# EAGLE design LONGAN_CORE (EAGLE 6.4)
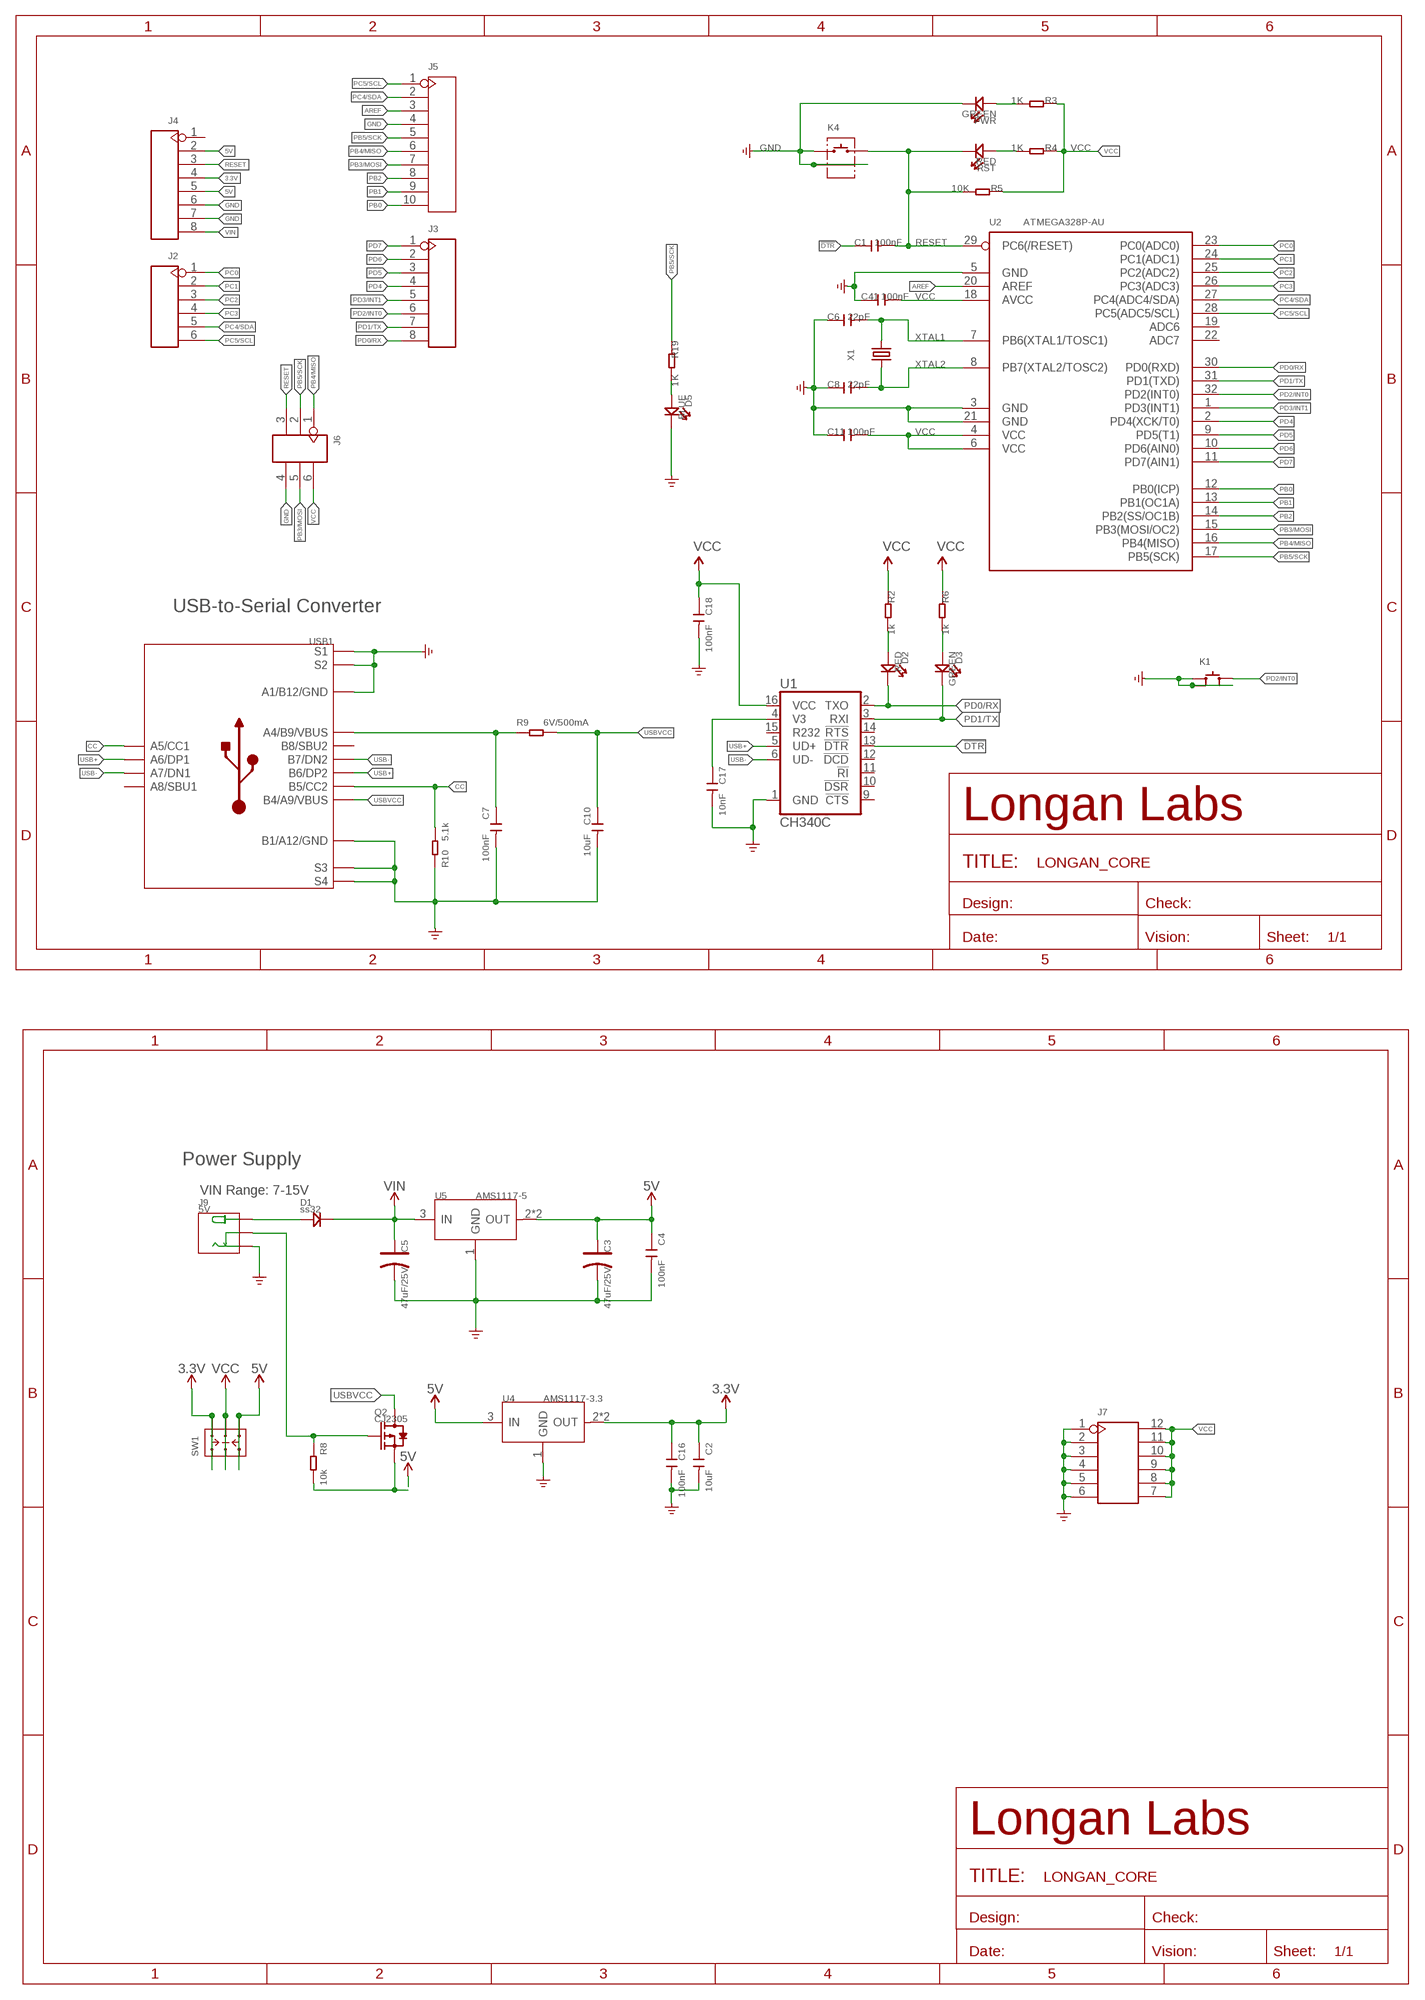
[diagram p0: schematic, sheet 1]

## Parts
C1  100nF  C-0603  [C0603]
C2  10uF  CAP-0603  [C0603]
C3  47uF/25V  CAP-POLAR-ELECTRO-C  [ELECTRO-SMD-C-6MM]
C4  100nF  CAP-0603  [C0603]
C5  47uF/25V  CAP-POLAR-ELECTRO-C  [ELECTRO-SMD-C-6MM]
C6  22pF  C-0603  [C0603]
C7  100nF  CAP-0603  [C0603]
C8  22pF  C-0603  [C0603]
C10  10uF  CAP-0603  [C0603]
C11  100nF  C-0603  [C0603]
C16  100nF  CAP-0603  [C0603]
C17  10nF  CAP-0603  [C0603]
C18  100nF  CAP-0603  [C0603]
C41  100nF  C-0603  [C0603]
D1  ss32  DIODE'SMA'  [DO-214AC]
D2  RED  LED'0603'  [LED-0603]
D3  GREEN  LED'0603'  [LED-0603]
D5  BLUE  LED'0603'  [LED-0603]
J2  HEADER-6P-55/35MIL  [H6-2.54]
J3  HEADER-8P-65/35MIL  [H8-2.54-C65D35MIL]
J4  HEADER-8P-65/35MIL  [H8-2.54-C65D35MIL]
J5  HEADER-10P-2.54  [H10-2.54]
J6  HEADER-2X3P-2.54  [H2X3-2.54]
J7  HEADER-2X6P-2.54  [H2X6-2.54]
J9  5V  POWER-JACK-DC-320120003  [DCJ3P-14.2X11.0X9.0MM]
K1  BUTTON-4P-6.2X6.2  [SW4-SMD-6.2X6.2MM]
K4  BUTTON-2+2P  [SW2+2P-7.7X2.75X3.95MM]
PWR  GREEN  LED'0603'  [LED-0603]
Q2  CJ2305  MOSFET-P'SI2323CDS/SI2305DS<BR>'  [SOT-23]
R2  1k  R-0603  [R0603]
R3  1K  R-0603  [R0603]
R4  1K  R-0603  [R0603]
R5  10K  R-0603  [R0603]
R6  1k  R-0603  [R0603]
R8  10k  RES-0603  [R0603]
R9  6V/500mA  RES-0805  [R0805]
R10  5.1k  RES-0603  [R0603]
R19  1K  R-0603  [R0603]
RST  RED  LED'0603'  [LED-0603]
SW1  SWITCH-2CH-6P-311010004  [SW6-2.54-9.0X3.5X3.2+2.0MM]
U1  CH340C  [SO016]
U2  ATMEGA328P-AU  MCU-ATMEGA8/168/328'AU'  [TQFP32-0.8-7X7MM]
U4  AMS1117-3.3  PMIC-CJ1117S  [SOT-223]
U5  AMS1117-5  PMIC-CJ1117S  [SOT-223]
USB1  TYPE-C-31-M-12  USB2.0-TYPE-C  [USB2.0-TYPE-C]
X1  16MHz  CRYSTAL-2P'HC49US'  [HC49US]

## Nets
3.3V: C2.1 C16.1 J4.4 SW1.CH1A SW1.CH2A U4.2(OUT) U4.TER(OUT)
5V: C3.+ C4.1 J4.2 J4.5 Q2.2(S) R8.2 SW1.CH1B SW1.CH2B U4.3(IN) U5.2(OUT) U5.TER(OUT)
!DTR: C1.1 U1.13(!DTR)
AREF: J5.3 U2.20(AREF)
CC: R10.2 USB1.A5(A5/CC1) USB1.B5(B5/CC2)
GND: C2.2 C3.- C4.2 C5.- C6.1 C7.2 C8.1 C10.2 C11.1 C16.2 C17.2 C18.2 C41.1 D5.- J4.6 J4.7 J5.4 J6.4 J7.1 J7.2 J7.3 J7.4 J7.5 J7.6 J9.-1(-) K1.1(A0) K1.3(B1) K1.4(A1) K4.1 K4.S1 K4.S2 PWR.- R10.1 U1.1(GND) U2.3(GND) U2.5(GND) U2.21(GND) U4.1(GND) U5.1(GND) USB1.A1_B12(A1/B12/GND) USB1.B1_A12(B1/A12/GND) USB1.S1 USB1.S2 USB1.S3 USB1.S4 USB1.S5(S1) USB1.S6(S2) ; supply symbol labelled GND_POWER
INSERT: J9.-2(CDN) Q2.1(G) R8.1
N$3: D5.+ R19.2
N$4: C7.1 R9.1 USB1.A4_B9(A4/B9/VBUS)
N$5: D3.+ R6.2
N$6: C17.1 U1.4(V3)
N$7: PWR.+ R3.2
N$9: D2.+ R2.2
N$17: R4.2 RST.+
PB0: J5.10 U2.12(PB0(ICP))
PB1: J5.9 U2.13(PB1(OC1A))
PB2: J5.8 U2.14(PB2(SS/OC1B))
PB3/MOSI: J5.7 J6.5 U2.15(PB3(MOSI/OC2))
PB4/MISO: J5.6 J6.1 U2.16(PB4(MISO))
PB5/SCK: J5.5 J6.2 R19.1 U2.17(PB5(SCK))
PC0: J2.1 U2.23(PC0(ADC0))
PC1: J2.2 U2.24(PC1(ADC1))
PC2: J2.3 U2.25(PC2(ADC2))
PC3: J2.4 U2.26(PC3(ADC3))
PC4/SDA: J2.5 J5.2 U2.27(PC4(ADC4/SDA))
PC5/SCL: J2.6 J5.1 U2.28(PC5(ADC5/SCL))
PD0/RX: D2.- J3.8 U1.2(TXO) U2.30(PD0(RXD))
PD1/TX: D3.- J3.7 U1.3(RXI) U2.31(PD1(TXD))
PD2/INT0: J3.6 K1.2(B0) U2.32(PD2(INT0))
PD3/INT1: J3.5 U2.1(PD3(INT1))
PD4: J3.4 U2.2(PD4(XCK/T0))
PD5: J3.3 U2.9(PD5(T1))
PD6: J3.2 U2.10(PD6(AIN0))
PD7: J3.1 U2.11(PD7(AIN1))
PWRIN: D1.1(+) J9.+
RESET: C1.2 J4.3 J6.3 K4.2 R5.2 RST.- U2.29(PC6(/RESET))
USB+: U1.5(UD+) USB1.A6(A6/DP1) USB1.B6(B6/DP2)
USB-: U1.6(UD-) USB1.A7(A7/DN1) USB1.B7(B7/DN2)
USBVCC: C10.1 Q2.3(D) R9.2 USB1.B4_A9(B4/A9/VBUS)
VCC: C11.2 C18.1 C41.2 J6.6 J7.7 J7.8 J7.9 J7.10 J7.11 J7.12 R2.1 R3.1 R4.1 R5.1 R6.1 SW1.COM1 SW1.COM2 U1.16(VCC) U2.4(VCC) U2.6(VCC) U2.18(AVCC)
VIN: C5.+ D1.2(-) J4.8 U5.3(IN)
XTAL1: C6.2 U2.7(PB6(XTAL1/TOSC1)) X1.2
XTAL2: C8.2 U2.8(PB7(XTAL2/TOSC2)) X1.1
Unconnected: J4.1 U1.9(!CTS) U1.10(!DSR) U1.11(!RI) U1.12(!DCD) U1.14(!RTS) U1.15(R232) U2.19(ADC6) U2.22(ADC7) USB1.A8(A8/SBU1) USB1.B8(B8/SBU2)

## Notes on the sheet
- USB-to-Serial Converter
- Power Supply
- VIN Range: 7-15V

## Library data of the parts
C1 C6 C8 C11 C41 = Discrete:C*: Ceramic Capacitors
C2 C4 C7 C10 C16-C18 = Discrete-new:CAP: Ceramic Capacitors
C3 C5 = Discrete-new:CAP-POLAR: Electrolytic Capacitors,Tantalum Capacitors and Super Capacitors
D1 = Discrete-new:DIODE
D2 D3 D5 PWR RST = Discrete-new:LED
J2 = Connector-new:HEADER-6P
J3 J4 = Connector-new:HEADER-8P
J5 = Connector-new:HEADER-10P
J6 = Connector-new:HEADER-2X3P
J7 = Connector-new:HEADER-2X6P
J9 = Connector-new:POWER-JACK-DC
K1 = Switch:BUTTON-4P
K4 = Connector-new:BUTTON-2+2P
Q2 = Discrete-new:MOSFET-P
R2-R6 R19 = Discrete:R*
R8-R10 = Discrete-new:RES
SW1 = Switch:SWITCH-2CH-6P
U1 = SparkFun-IC-Comms:CH340C; PROD_ID: IC-14038
U2 = IC-new:MCU-ATMEGA8/168/328
U4 U5 = IC-new:PMIC-CJ*1117: Low Drop Fixed And Adjustable Positive Voltage Regulators http://www.datasheetcatalog.org/datasheet/SGSThomsonMicroelectronics/mXuqtqv.pdf
USB1 = Connector-new:USB2.0-TYPE-C
X1 = Discrete-new:CRYSTAL-2P

## Net classes
1 power: width 0.152 mm, drill 0.152 mm, clearance 0.152 mm
2 gnd: width 0.152 mm, drill 0.152 mm, clearance 0.152 mm
3 usbvcc: width 0.152 mm, drill 0.152 mm, clearance 0.152 mm

## Board
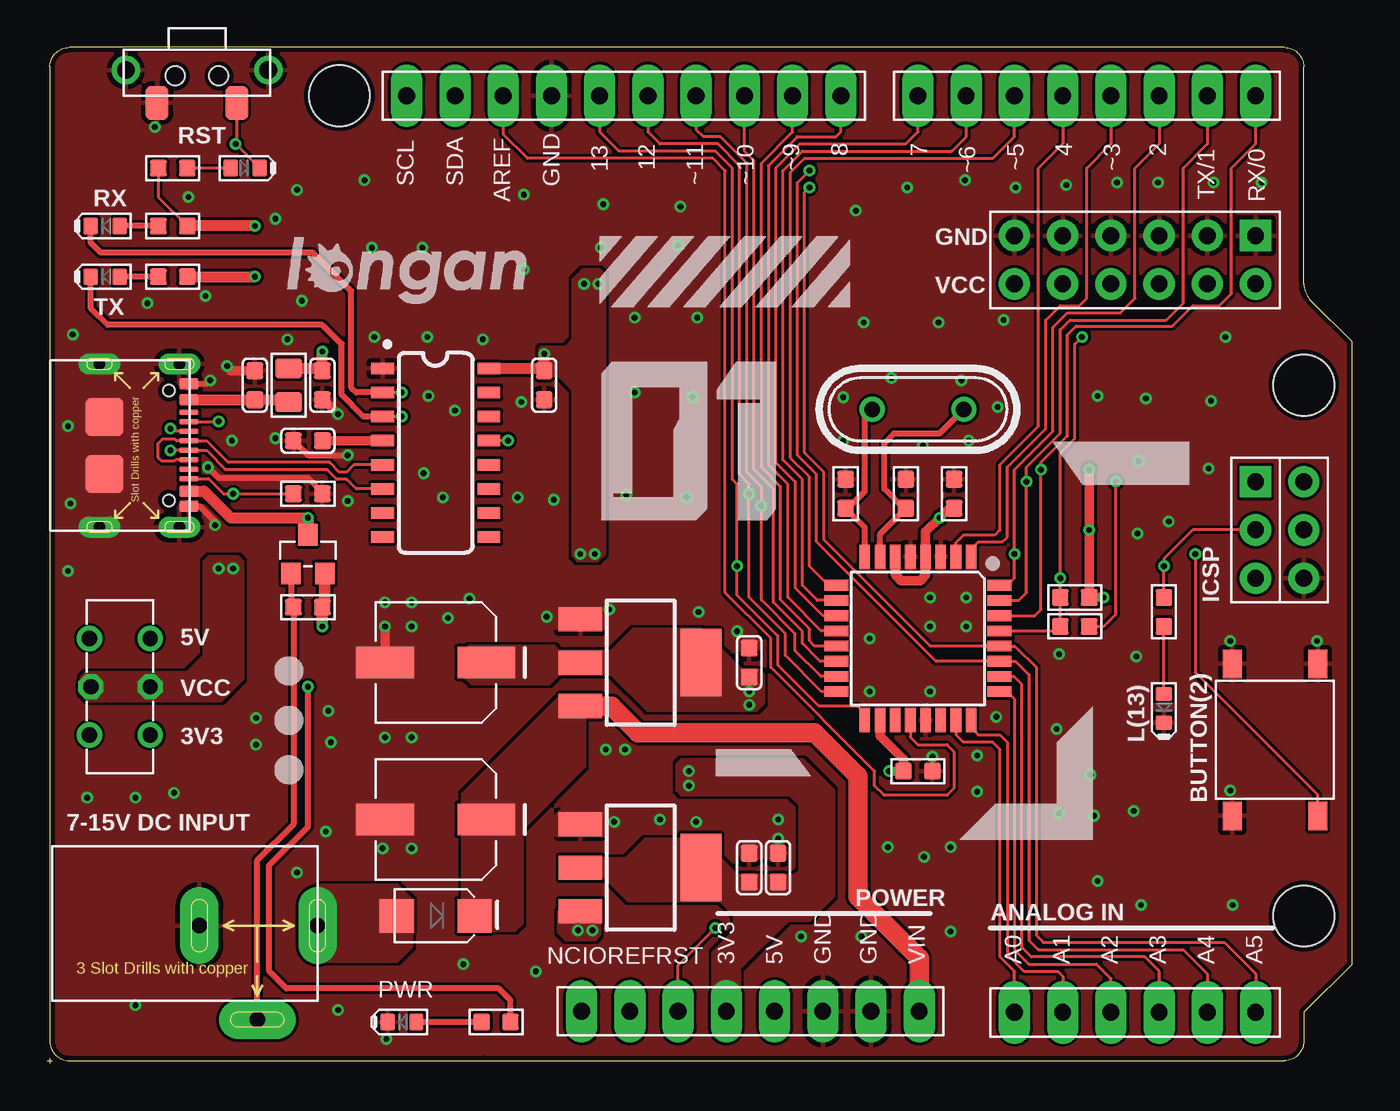
[diagram p1: board, top side]
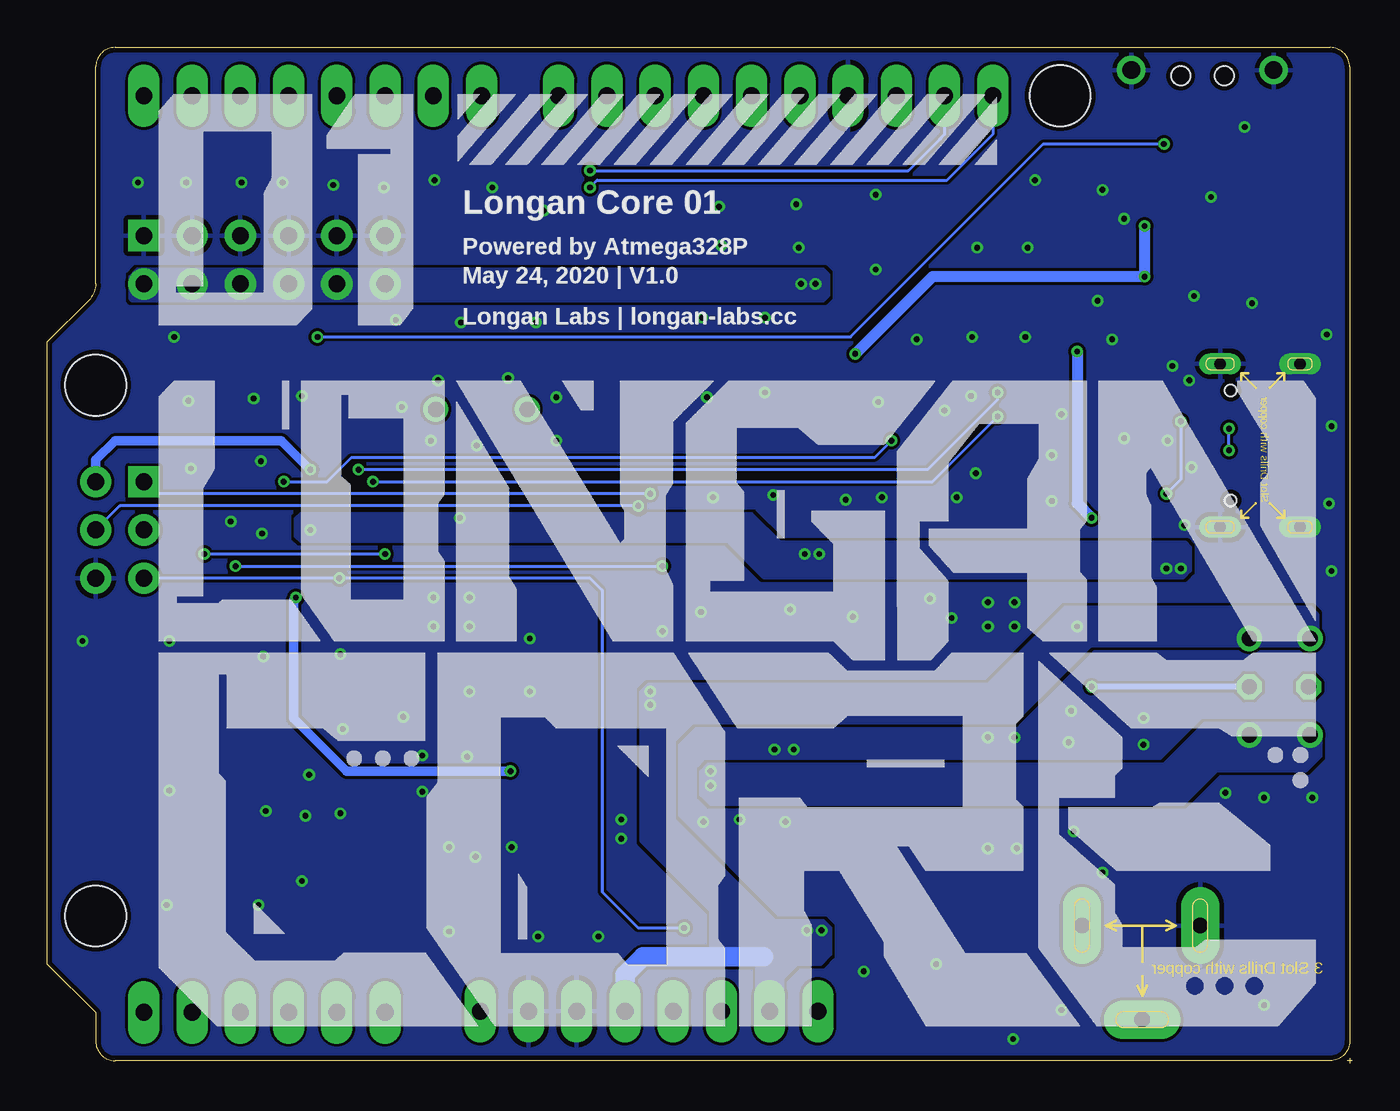
[diagram p2: board, bottom side, seen from below]

Size 68.71 x 53.47 mm. Coordinates in mm from the lower left corner, seen from the top.
Outline: 66.17,41.04 arc45 66.54,40.14 68.71,37.97 68.71,5.21 66.17,2.67 66.17,1.14 arc-90 65.15,0.13 23,0.13
Outline: 66.17,41.02 66.17,52.45 arc90 65.15,53.47 1.14,53.47 arc90 0.13,52.45 0.13,1.14 arc90 1.14,0.13 22.98,0.13
Outline: 0,0.13 0.13,0.13
Outline: 0.13,0.13 0.25,0.13
Outline: 0.13,0.25 0.13,0.13
Outline: 0.13,0.13 0.13,0
Copper layers (1*16): Top 0.035mm / dielectric 1.5mm / Bottom 0.035mm
Design rules "SeeedStudio_2layer_DRU_no_angle_20140221 *": minimum track width 6mil, minimum drill 10mil, track to track 6mil, track to pad 6mil, pad to pad 6mil, via to via 6mil, smd to smd 0mil, copper to edge 10mil, drill to drill 10mil, minimum pad ring 10mil, minimum via ring 6mil, stop-mask expansion 2mil, vias tented up to drill 100mil, thermal gap 10mil
Holes 3.2 mm at 15.37,50.93 66.17,35.69 66.17,7.75

### Footprints (pad centres in the part's own frame; a part is rotated, then mirrored left to right if it is on the bottom)
C0603 = smd 0.889 x 0.889: 1 -0.762,0; 2 0.762,0
ELECTRO-SMD-C-6MM = smd 3.048 x 1.651: + 2.667,0; - -2.667,0
DO-214AC = smd 1.8 x 1.77: 1 2.042,0; 2 -2.042,0
LED-0603 = smd 0.762 x 0.889: + 0.762,0; - -0.762,0
H6-2.54 = drill 0.889 pad 1.651 long: 1 0,6.35; 2 0,3.81; 3 0,1.27; 4 0,-1.27; 5 0,-3.81; 6 0,-6.35
H8-2.54-C65D35MIL = drill 0.889 pad 1.651 long: 1 0,8.89; 2 0,6.35; 3 0,3.81; 4 0,1.27; 5 0,-1.27; 6 0,-3.81; 7 0,-6.35; 8 0,-8.89
H10-2.54 = drill 0.889 pad 1.651 long: 1 0,11.43; 2 0,8.89; 3 0,6.35; 4 0,3.81; 5 0,1.27; 6 0,-1.27; 7 0,-3.81; 8 0,-6.35; 9 0,-8.89; 10 0,-11.43
H2X3-2.54 = drill 0.889 pad 1.651 square: 1 -1.27,2.54 | drill 0.889 pad 1.651: 2 -1.27,0; 3 -1.27,-2.54; 4 1.27,-2.54; 5 1.27,0; 6 1.27,2.54
H2X6-2.54 = drill 0.889 pad 1.651 square: 1 -1.27,6.35 | drill 0.889 pad 1.651: 2 -1.27,3.81; 3 -1.27,1.27; 4 -1.27,-1.27; 5 -1.27,-3.81; 6 -1.27,-6.35; 7 1.27,-6.35; 8 1.27,-3.81; 9 1.27,-1.27; 10 1.27,1.27; 11 1.27,3.81; 12 1.27,6.35
DCJ3P-14.2X11.0X9.0MM = drill 0.813 pad 2.032 long: + 3.175,0; -1 -3.048,0; -2 0,-4.953
SW4-SMD-6.2X6.2MM = smd 1.5 x 1: 1 -4,2.25; 2 -4,-2.25; 3 4,-2.25; 4 4,2.25
SW2+2P-7.7X2.75X3.95MM = smd 1.2 x 1.778: 1 -2.1,-0.127; 2 2.1,-0.127 | drill 0.924 pad 1.5: S1 -3.75,1.6; S2 3.75,1.6 | hole 1: -1.15,1.3; 1.15,1.3
SOT-23 = smd 1.143 x 1.016: 1 1.016,-0.889; 2 1.016,0.889; 3 -1.016,0
R0603 = smd 0.889 x 0.889: 1 -0.762,0; 2 0.762,0
R0805 = smd 1.016 x 1.397: 1 -0.889,0; 2 0.889,0
SW6-2.54-9.0X3.5X3.2+2.0MM = drill 0.813 pad 1.27: CH1A -2.54,-1.6; CH1B 2.54,-1.6; CH2A -2.54,1.6; CH2B 2.54,1.6 | drill 0.813 pad 1.27 octagon: COM1 0,-1.6; COM2 0,1.524
SO016 = smd 0.6 x 1.2: 1 -4.445,-2.8; 2 -3.175,-2.8; 3 -1.905,-2.8; 4 -0.635,-2.8; 5 0.635,-2.8; 6 1.905,-2.8; 7 3.175,-2.8; 8 4.445,-2.8; 9 4.445,2.8; 10 3.175,2.8; 11 1.905,2.8; 12 0.635,2.8; 13 -0.635,2.8; 14 -1.905,2.8; 15 -3.175,2.8; 16 -4.445,2.8
TQFP32-0.8-7X7MM = smd 1.27 x 0.559: 1 -4.293,2.8; 2 -4.293,2; 3 -4.293,1.2; 4 -4.293,0.4; 5 -4.293,-0.4; 6 -4.293,-1.2; 7 -4.293,-2; 8 -4.293,-2.8; 17 4.293,-2.8; 18 4.293,-2; 19 4.293,-1.2; 20 4.293,-0.4; 21 4.293,0.4; 22 4.293,1.2; 23 4.293,2; 24 4.293,2.8 | smd 0.559 x 1.27: 9 -2.8,-4.293; 10 -2,-4.293; 11 -1.2,-4.293; 12 -0.4,-4.293; 13 0.4,-4.293; 14 1.2,-4.293; 15 2,-4.293; 16 2.8,-4.293; 25 2.8,4.293; 26 2,4.293; 27 1.2,4.293; 28 0.4,4.293; 29 -0.4,4.293; 30 -1.2,4.293; 31 -2,4.293; 32 -2.8,4.293
SOT-223 = smd 1.27 x 2.286: 1 -2.286,-3.175; 2 0,-3.175; 3 2.286,-3.175 | smd 3.556 x 2.159: TER 0,3.175
USB2.0-TYPE-C = smd 1 x 0.6: A1_B12 -0.05,3.25; A4_B9 -0.05,2.4; B1_A12 -0.05,-3.2; B4_A9 -0.05,-2.4 | smd 1 x 0.3: A5 -0.05,1.25; A6 -0.05,0.25; A7 -0.05,-0.25; A8 -0.05,-1.25; B5 -0.05,-1.75; B6 -0.05,-0.75; B7 -0.05,0.75; B8 -0.05,1.75 | drill 0.6 pad 1 long: S1 -4.75,4.3; S2 -4.75,-4.3 | drill 0.6 pad 1.1 long: S3 -0.55,4.3; S4 -0.55,-4.3 | smd 2 x 2: S5 -4.5,1.5; S6 -4.5,-1.5 | hole 0.6: -1.1,-2.89; -1.1,2.89
HC49US = drill 0.813: 1 -2.413,0; 2 2.413,0

### Placement (x,y rotation side)
C1  54.1,22.99 180 top
C2  36.96,10.29 90 top
C3  20.45,21.08 0 top
C4  36.96,21.08 90 top
C5  20.45,12.83 0 top
C6  45.21,29.97 270 top
C7  10.92,35.69 90 top
C8  42.04,29.97 270 top
C10  14.48,35.69 270 top
C11  47.75,29.97 270 top
C16  38.48,10.29 90 top
C17  13.72,32.77 180 top
C18  26.16,35.69 270 top
C41  45.85,15.37 180 top
D1  20.45,7.75 180 top
D2  3.05,44.07 0 top
D3  3.05,41.4 0 top
D5  58.8,18.67 90 top
J2  57.28,2.67 90 top
J3  54.74,50.93 90 top
J4  37.02,2.73 90 top
J5  30.35,50.93 90 top
J6  64.9,28.07 0 top
J7  57.28,42.29 270 top
J9  11.05,7.24 0 top
K1  64.64,17.02 90 top
K4  7.87,50.67 0 top
PWR  18.67,2.16 0 top
Q2  13.72,26.8 270 top
R2  6.6,44.07 180 top
R3  23.62,2.16 180 top
R4  6.6,47.12 0 top
R5  54.1,24.51 180 top
R6  6.6,41.4 180 top
R8  13.72,24 0 top
R9  12.7,35.69 90 top
R10  13.72,29.97 180 top
R19  58.8,23.75 270 top
RST  10.41,47.12 180 top
SW1  3.81,19.81 90 top
U1  20.45,32.13 270 top
U2  45.85,22.35 270 top
U4  31.24,10.29 270 top
U5  31.24,21.08 270 top
USB1  7.49,32.51 0 top
X1  45.85,34.42 0 top

### Tracks (layer width: path | path; a pad name or v marks a point on that pad's centre or on a via)
3.3V  (via drill 0.3 pad 0.61)
  other vias: 33.78,15.37 33.78,14.61
  pour Top (isolate 0.254, no thermals): 27.81,10.79 30.48,10.79 31.5,11.81 34.42,11.81 36.32,9.91 39.37,9.91 39.62,10.16 39.62,13.59 39.12,14.1 33.4,14.1 33.15,14.35 33.15,15.75 33.4,16 39.79,16 41.4,14.39 41.4,8.76 40.13,7.49 38.99,7.49 36.45,4.95 36.45,1.91 36.07,1.52 35.43,1.52 35.05,1.91 35.05,5.84 36.2,6.98 36.2,7.75 35.43,8.51 30.61,8.51 29.34,9.78 27.69,9.78 27.56,9.91 27.56,10.54
  pour Bottom (isolate 0.254, no thermals): 33.78,15.75 9.91,15.75 7.75,17.91 2.16,17.91 1.65,17.4 1.65,16.13 2.41,15.37 7.11,15.37 8.89,13.59 33.78,13.59 34.29,14.1 34.29,15.37 33.91,15.75
5V  (via drill 0.3 pad 0.61)
  Top 0.61: v14.48,22.99 R8.2 14.61,24.13 Q2.2
  Bottom 1.016: J4.5 38.29,4.63 37.34,5.59 30.99,5.59
  other vias: 36.96,19.56 36.96,18.86 28.7,6.98 27.94,6.98
  pour Top (isolate 0.254, no thermals): 22.22,21.97 26.67,21.97 26.92,21.72 29.72,21.72 30.86,22.86 34.42,22.86 36.58,20.7 37.47,20.7 37.72,20.45 37.72,18.92 37.34,18.54 31.62,18.54 29.72,20.45 26.92,20.45 26.42,19.94 22.35,19.94 21.97,20.32 21.97,21.72
  pour Bottom (isolate 0.254, no thermals): 35.69,12.83 35.69,16.94 34.72,17.91 17.78,17.91 13.72,21.97 2.03,21.97 1.78,22.22 1.78,23.62 2.16,24 15.11,24 19.18,19.94 37.08,19.94 37.47,19.56 37.47,11.68 33.78,8 33.78,5.97 33.53,5.71 31.5,5.71 31.37,5.59 31.37,2.41 30.99,2.03 30.1,2.03 29.97,2.16 29.97,4.44 29.21,5.21 27.94,5.21 27.43,5.71 27.43,7.11 27.81,7.49 30.35,7.49
  pour Top (isolate 0.254, no thermals): 27.81,8.38 28.7,8.38 29.08,8 29.08,6.73 28.83,6.48 27.3,6.48 26.92,6.86 26.92,8 27.3,8.38
!DTR  (via drill 0.3 pad 0.61)
  Top 0.152: C1.1 55.63,22.99 56.26,23.62 v56.26,30.61 | v24.26,32.77 U1.13
  Bottom 0.152: v24.26,32.77 25.15,31.88 52.71,31.88 53.98,30.61 v56.26,30.61
AREF
  Top 0.152: U2.20 45.45,17.16 45.85,16.76 47.37,16.76 47.75,16.38 47.75,14.48 47.37,14.1 44.07,14.1 43.56,14.61 43.56,15.37 38.1,20.83 38.1,22.35 35.69,24.77 35.69,46.99 35.05,47.62 25.27,47.62 24,48.9 J5.3
CC  (via drill 0.3 pad 0.61)
  Top 0.152: USB1.B5 8.48,30.76 9.27,29.97 9.65,29.97 v9.78,29.97 R10.2 | USB1.A5 9,33.76 v9.02,33.78
  Bottom 0.152: v9.02,33.78 9.02,30.73 v9.78,29.97
GND  (via drill 0.3 pad 0.61)
  Top 0.305: R10.1 14.48,30.04 13.72,30.8 9.02,30.8 v8.45,31.37 | C17.2 13.72,32 v15.81,32 | USB1.B1_A12 8.03,29.31 8.89,28.45 8.89,28.38 v8.83,28.32 | USB1.A1_B12 8.33,35.76 8.51,35.94 v8.57,35.94
  Top 0.508: C3.- v17.78,22.99 | C7.2 9.65,36.45 9.4,36.7 v9.46,36.7 | C10.2 14.54,34.93 v15.3,34.16
  other vias: 19.18,22.99 19.18,24.26 17.78,24.26 17.78,17.14 19.18,17.14 19.18,11.3 17.65,11.3 29.59,23.88 26.29,23.49 34.29,23.75 36.32,22.73 29.84,12.7 32.26,12.83 34.16,12.7 38.48,12.83 38.48,11.81 17.84,1.27 46.61,16.13 46.48,19.56 43.31,19.56 43.31,22.35 46.48,22.99 48.39,22.99 48.39,24.51 46.48,24.51 48.51,32.77 41.91,32.77 41.91,35.05 44.45,36.07 48.13,35.94 50.04,34.54 46.1,32.51 57.47,31.69 61.15,31.31 61.28,34.86 57.85,34.99 55.12,13.02 62.29,14.35 62.29,22.22 66.87,22.22 39.69,6.67 42.86,6.67 47.56,6.92 47.56,11.37 44.26,11.37 46.16,10.86 55.31,9.59 53.28,13.14 53.15,17.59 53.28,21.53 57.34,21.4 54.93,15.18 57.21,13.27 57.59,8.32 62.42,8.32 62.04,38.23 63.94,46.36 61.4,46.36 58.48,46.36 56.32,46.36 53.66,46.23 50.99,46.1 48.32,46.48 45.28,46.1 42.57,44.88 42.99,38.99 46.93,38.99 50.36,39.12 34.23,39.24 30.92,39.24 30.92,35.31 33.97,35.05 24.96,34.8 22.92,38.1 25.08,41.78 25.08,45.72 29.27,45.21 33.21,43.05 29.15,42.93 33.34,45.09 20,38.23 17.21,38.23 17.08,42.93 19.75,42.93 16.7,46.48 13.14,45.97 12,44.45 13.4,40.13 8.32,40.39 5.27,40.01 7.43,45.59 12.64,38.1 12,32.89 15.81,29.59 9.72,32.77 5.65,49.28 1.33,38.35 1.08,33.53 1.21,29.46 1.08,25.91 10.99,18.16 10.99,16.76 14.92,16.89 14.8,18.54 14.67,12.19 13.14,10.03 6.67,14.22 4.64,13.97 2.1,13.97 15.3,2.79 4.64,3.05 21.91,5.21 25.72,4.83 29.4,16.51 30.42,16.51 30.48,29.91 33.66,29.78 26.67,29.65 24.77,29.78 20.83,29.78 19.81,31.05 20.07,35.12 21.46,34.35 22.22,24.45 21.08,23.43 48.96,14.29 48.96,16.19 49.97,18.22 55.31,35.12 57.4,27.88 59.05,28.51
  pour Top (isolate 0.152, rank 6): 0.13,53.47 68.71,53.47 68.71,0.13 0.13,0.13
  pour Bottom (isolate 0.152, rank 6): 0.13,53.47 68.71,53.47 68.71,0.13 2.67,0.13 2.67,-0.51 0.13,-0.51
  pour Top (isolate 0.254, no thermals): 17.65,24.64 16.64,24.64 16,24 16,11.43 16.76,10.67 19.43,10.67 19.81,11.05 19.81,24.26 19.43,24.64
  pour Top (isolate 0.254, no thermals): 36.07,22.22 36.07,22.99 35.69,23.37 29.84,23.37 29.34,22.86 25.15,22.86 24.89,23.11 24.89,24.77 25.27,25.15 34.93,25.15 37.47,22.61 37.47,21.84 37.21,21.59 36.58,21.59 36.07,22.1
  pour Top (isolate 0.254, no thermals): 29.59,13.46 38.23,13.46 38.73,12.95 38.73,10.92 38.61,10.79 36.58,10.79 36.32,11.05 36.32,12.07 35.94,12.45 30.35,12.45 29.84,11.94 26.8,11.94 26.67,12.07 26.67,12.95 27.18,13.46
INSERT
  Top 0.305: Q2.1 12.83,24.13 R8.1 12.95,12.57 11.05,10.67 J9.-2
N$3
  Top 0.152: D5.+ R19.2
N$4
  Top 0.584: USB1.A4_B9 10.91,34.91 C7.1 12.57,34.93 R9.1
N$5
  Top 0.305: R6.2 D3.+
N$6
  Top 0.508: C17.1 U1.4
N$7
  Top 0.305: R3.2 PWR.+
N$9
  Top 0.305: R2.2 D2.+
N$17
  Top 0.152: RST.+ R4.2
PB0
  Top 0.152: U2.12 40.75,22.75 38.99,24.51 38.99,30.48 38.86,30.61 38.8,30.67 37.97,31.5 37.97,47.24 39.5,48.77 41.53,48.77 41.78,49.02 J5.10
PB1
  Top 0.152: U2.13 40.41,21.95 40.13,22.22 40.13,22.86 38.61,24.38 38.61,30.35 37.59,31.37 37.59,47.37 39.24,49.02 J5.9
PB2
  Top 0.152: U2.14 40.7,21.15 39.75,22.1 39.75,22.73 38.23,24.26 38.23,30.23 37.21,31.24 37.21,47.5 36.77,47.94 36.7,48.01 J5.8
PB3/MOSI  (via drill 0.3 pad 0.61)
  Top 0.152: U2.15 40.73,20.35 39.37,21.72 39.37,22.61 37.59,24.38 v37.59,29.34 37.59,30.35 36.83,31.11 36.83,47.37 35.43,48.77 34.54,48.77 34.16,49.15 J5.7
  Bottom 0.152: v37.59,29.34 64.9,29.34 J6.5
PB4/MISO  (via drill 0.3 pad 0.61)
  Top 0.152: U2.16 40.77,19.55 38.86,21.46 38.86,22.61 36.96,24.51 v36.96,29.97 36.96,30.48 36.45,30.99 36.45,47.24 35.31,48.39 32.26,48.39 31.62,49.02 J5.6
  Bottom 0.152: v36.96,29.97 62.99,29.97 J6.1
PB5/SCK  (via drill 0.3 pad 0.61)
  Top 0.152: U2.17 43.05,18.42 42.67,18.8 40.64,18.8 38.48,20.95 38.48,22.48 36.32,24.64 v36.32,26.16 36.32,30.48 36.07,30.73 36.07,47.12 35.18,48.01 30.1,48.01 29.08,49.02 J5.5 | R19.1 v58.8,26.16 58.8,26.54 60.33,28.07 J6.2
  Bottom 0.152: v58.8,26.16 v36.32,26.16
PC0
  Top 0.152: U2.23 47.85,17.27 48.23,16.89 49.78,16.89 50.16,16.51 50.16,5.59 50.93,4.83 J2.1
PC1
  Top 0.152: U2.24 48.65,17.65 49.02,17.27 50.16,17.27 50.55,16.89 50.55,5.71 51.44,4.83 53.21,4.83 53.47,4.57 J2.2
PC2
  Top 0.152: U2.25 50.55,19.55 50.93,19.18 50.93,5.97 51.69,5.21 55.25,5.21 56.01,4.44 J2.3
PC3
  Top 0.152: U2.26 50.9,20.35 51.31,19.94 51.31,6.1 51.82,5.59 57.79,5.59 58.55,4.83 J2.4
PC4/SDA  (via drill 0.3 pad 0.61)
  Top 0.152: v40.13,46.99 39.5,46.36 39.5,32 40.51,30.99 40.51,27.43 46.79,21.15 U2.27 50.98,21.15 51.69,20.45 51.69,6.48 52.2,5.97 59.82,5.97 61.09,4.7 J2.5
  Bottom 0.152: v40.13,46.99 23.37,46.99 21.72,48.64 21.59,48.77 21.46,48.9 J5.2
PC5/SCL  (via drill 0.3 pad 0.61)
  Top 0.152: v40.13,46.1 39.88,45.85 39.88,32.13 40.89,31.11 40.89,27.56 46.5,21.95 U2.28 50.95,21.95 52.07,20.83 52.07,6.73 52.45,6.35 61.98,6.35 63.63,4.7 J2.6
  Bottom 0.152: v40.13,46.1 39.75,46.48 21.34,46.48 18.92,48.9 J5.1
PD0/RX  (via drill 0.3 pad 0.61)
  Top 0.152: U2.30 52,23.55 52.32,23.88 v52.32,31.24 52.32,31.62 53.72,33.02 53.72,38.35 54.16,38.8 59.25,38.8 60.33,39.88 61.72,39.88 62.36,40.51 62.36,47.12 63.63,48.39 J3.8 | U1.2 v18.67,35.31
  Top 0.305: U1.2 16.26,35.31 16,35.56 16,40.64 13.97,42.67 2.79,42.67 2.29,43.18 D2.-
  Bottom 0.152: v18.67,35.31 18.67,34.93 22.35,31.24 v52.32,31.24
PD1/TX  (via drill 0.3 pad 0.61)
  Top 0.152: U2.31 51.15,24.35 51.56,24.77 v51.56,30.61 51.56,31.37 53.34,33.15 53.34,38.61 53.85,39.12 58.93,39.12 59.82,40.01 59.82,47.12 61.09,48.39 J3.7 | v18.67,34.04 U1.3
  Top 0.305: D3.- 2.29,39.75 3.17,38.86 14.48,38.86 15.49,37.85 15.49,35.18 16.64,34.04 U1.3
  Bottom 0.152: v51.56,30.61 22.1,30.61 v18.67,34.04
PD2/INT0  (via drill 0.3 pad 0.61)
  Top 0.152: U2.32 50.55,25.15 50.93,25.53 v50.93,26.8 50.93,31.24 52.96,33.27 52.96,38.73 53.72,39.5 56.52,39.5 57.28,40.26 57.28,47.12 58.55,48.39 J3.6 | v60.45,26.8 60.45,20.57 66.89,14.13 K1.2
  Bottom 0.152: v50.93,26.8 v60.45,26.8
PD3/INT1
  Top 0.152: U2.1 48.65,27.06 49.02,27.43 50.29,27.43 50.55,27.69 50.55,31.37 52.58,33.4 52.58,39.12 53.34,39.88 54.36,39.88 54.74,40.26 54.74,47.12 56.01,48.39 J3.5
PD4
  Top 0.152: U2.2 47.85,27.4 48.26,27.81 49.91,27.81 50.16,28.07 50.16,31.5 52.2,33.53 52.2,47.12 53.47,48.39 J3.4
PD5
  Top 0.152: U2.9 41.14,25.15 40.13,26.16 40.13,30.86 39.12,31.88 39.12,46.86 39.88,47.62 49.78,47.62 50.93,48.77 J3.3
PD6
  Top 0.152: U2.10 40.55,24.35 39.75,25.15 39.75,30.73 38.73,31.75 38.73,46.99 39.75,48.01 47.62,48.01 48.39,48.77 J3.2
PD7
  Top 0.152: U2.11 40.84,23.55 39.37,25.02 39.37,30.61 38.35,31.62 38.35,47.12 39.62,48.39 45.21,48.39 45.85,49.02 J3.1
PWRIN
  pour Top (isolate 0.254, no thermals): 14.48,9.4 18.41,9.4 19.18,8.64 19.18,6.1 18.41,5.33 14.35,5.33 13.46,6.22 13.46,8.51 14.35,9.4
RESET  (via drill 0.3 pad 0.61)
  Top 0.152: U2.29 53.11,22.75 C1.2 R5.2 v53.34,25.53 53.34,32.13 54.1,32.89 54.1,37.85 v54.48,38.23 | K4.2 9.97,48.46 v9.91,48.39 RST.- | J4.3 33.21,5.14 v35.18,7.11
  Bottom 0.152: v54.48,38.23 26.42,38.23 16.26,48.39 v9.91,48.39 | J6.3 v53.34,25.53 40.13,25.53 39.5,24.89 39.5,9.02 37.59,7.11 v35.18,7.11
USB+
  Top 0.152: U1.5 16.13,31.5 15.75,31.11 15.37,31.11 14.86,31.62 9.53,31.62 8.39,32.76 USB1.A6 6.8,32.76 6.73,32.83 6.03,32.83 5.84,32.64 5.84,31.88 6.03,31.69 6.67,31.69 6.74,31.76 USB1.B6
USB-  (via drill 0.3 pad 0.61)
  Top 0.152: U1.6 16.26,30.23 15.75,30.73 15.24,30.73 14.73,31.24 9.4,31.24 8.38,32.26 USB1.A7 v6.48,32.26 | USB1.B7 6.62,33.26 v6.48,33.4
  Bottom 0.152: v6.48,32.26 v6.48,33.4
USBVCC  (via drill 0.3 pad 0.61)
  Top 0.584: R9.2 14.35,36.58 C10.1 v14.48,37.47 | Q2.3 v13.72,28.7 9.65,28.7 8.24,30.11 USB1.B4_A9
  Bottom 0.584: v14.48,37.47 14.48,29.46 v13.72,28.7
VCC  (via drill 0.3 pad 0.61)
  Top 0.152: R4.1 5.84,45.59 R2.1
  Top 0.305: R3.1 24.38,3.3 23.75,3.94 12.57,3.94 11.68,4.83 11.68,10.41 13.72,12.45 v13.72,19.81
  Top 0.508: U2.6 44.65,25.71 44.96,25.4 45.97,25.4 46.25,25.67 U2.4 46.25,27.96 v46.99,28.7 47.5,29.21 C11.2 | v44.32,15.37 C41.2 45.09,16 43.85,17.24 U2.18 | v54.86,31.24 v54.86,28.07 R5.1 v55.63,24.51
  Top 0.584: R6.1 v10.92,41.4 | v10.92,44.07 R2.1 | v26.16,37.34 C18.1 26.04,36.58 U1.16
  Bottom 0.305: SW1.COM1 v13.72,19.81
  Bottom 0.508: J6.6 66.17,31.75 65.15,32.77 56.39,32.77 v54.86,31.24 | v44.32,15.37 52.96,15.37 55.75,18.16 55.75,24.38 v55.63,24.51
  Bottom 0.584: v10.92,44.07 v10.92,41.4 22.1,41.4 v26.16,37.34
  other vias: 9.78,26.04 9.02,26.04 28.07,26.8 28.83,26.8 29.02,41.02 28.26,41.02
  pour Top (isolate 0.254, no thermals): 2.03,20.57 7.37,20.57 8.26,21.46 8.26,26.42 8.51,26.67 10.03,26.67 10.29,26.42 10.29,20.19 9.14,19.05 2.16,19.05 1.78,19.43 1.78,20.32
  pour Bottom (isolate 0.254, no thermals): 8.89,25.53 30.99,25.53 32.89,27.43 55.37,27.43 55.63,27.69 55.63,28.7 55.37,28.96 31.62,28.96 30.1,27.43 8.76,27.43 8.51,27.18 8.51,25.91
  pour Top (isolate 0.254, no thermals): 27.69,26.67 27.69,35.43 26.92,36.2 26.29,36.2 25.91,36.58 25.91,37.59 26.04,37.72 27.3,37.72 27.69,38.1 27.69,41.28 28.19,41.78 29.08,41.78 29.34,41.53 29.34,26.8 28.96,26.42 27.94,26.42
  pour Bottom (isolate 0.254, no thermals): 64.26,40.13 27.81,40.13 27.56,40.39 27.56,41.53 27.81,41.78 64.01,41.78 64.39,41.4 64.39,40.26
VIN
  Top 1.016: U5.3 29.72,18.8 31.11,17.4 40.38,17.4 42.67,15.11 42.67,8.76 45.21,6.22 45.34,6.1 45.91,5.52 J4.8
  pour Top (isolate 0.254, no thermals): 27.81,19.3 26.99,19.3 21.84,14.16 21.84,7.49 22.35,6.98 24.64,6.98 25.02,7.37 25.02,12.32 28.32,15.62 28.32,18.8
XTAL1
  Top 0.305: U2.7 43.85,27.84 C6.2 45.09,29.21 44.07,30.23 44.07,32.64 44.58,33.15 46.99,33.15 X1.2
XTAL2
  Top 0.305: U2.8 43.05,28.2 C8.2 42.16,29.21 43.05,30.1 43.05,34.04 X1.1

### Text on the board
tPlace: RST | 8 | 7 | 4 | 2 | 13 | 12 | ~9 | ~6 | ~5 | ~3 | SCL | SDA | GND | ~11 | ~10 | RX | AREF | TX/1 | RX/0 | GND | VCC | TX | ICSP | 5V | VCC | 3V3 | L(13) | BUTTON(2) | 7-15V DC INPUT | POWER | ANALOG IN | IOREF | RST | NC | 3V3 | 5V | GND | GND | VIN | A0 | A1 | A2 | A3 | A4 | A5 | PWR
bPlace: Longan Core 01 | Powered by Atmega328P | May 24, 2020 | V1.0 | Longan Labs | longan-labs.cc
Modules: USB | Switch | ANALOG | BLE_MODULE